# EAGLE design pacemaker (EAGLE 4.11)
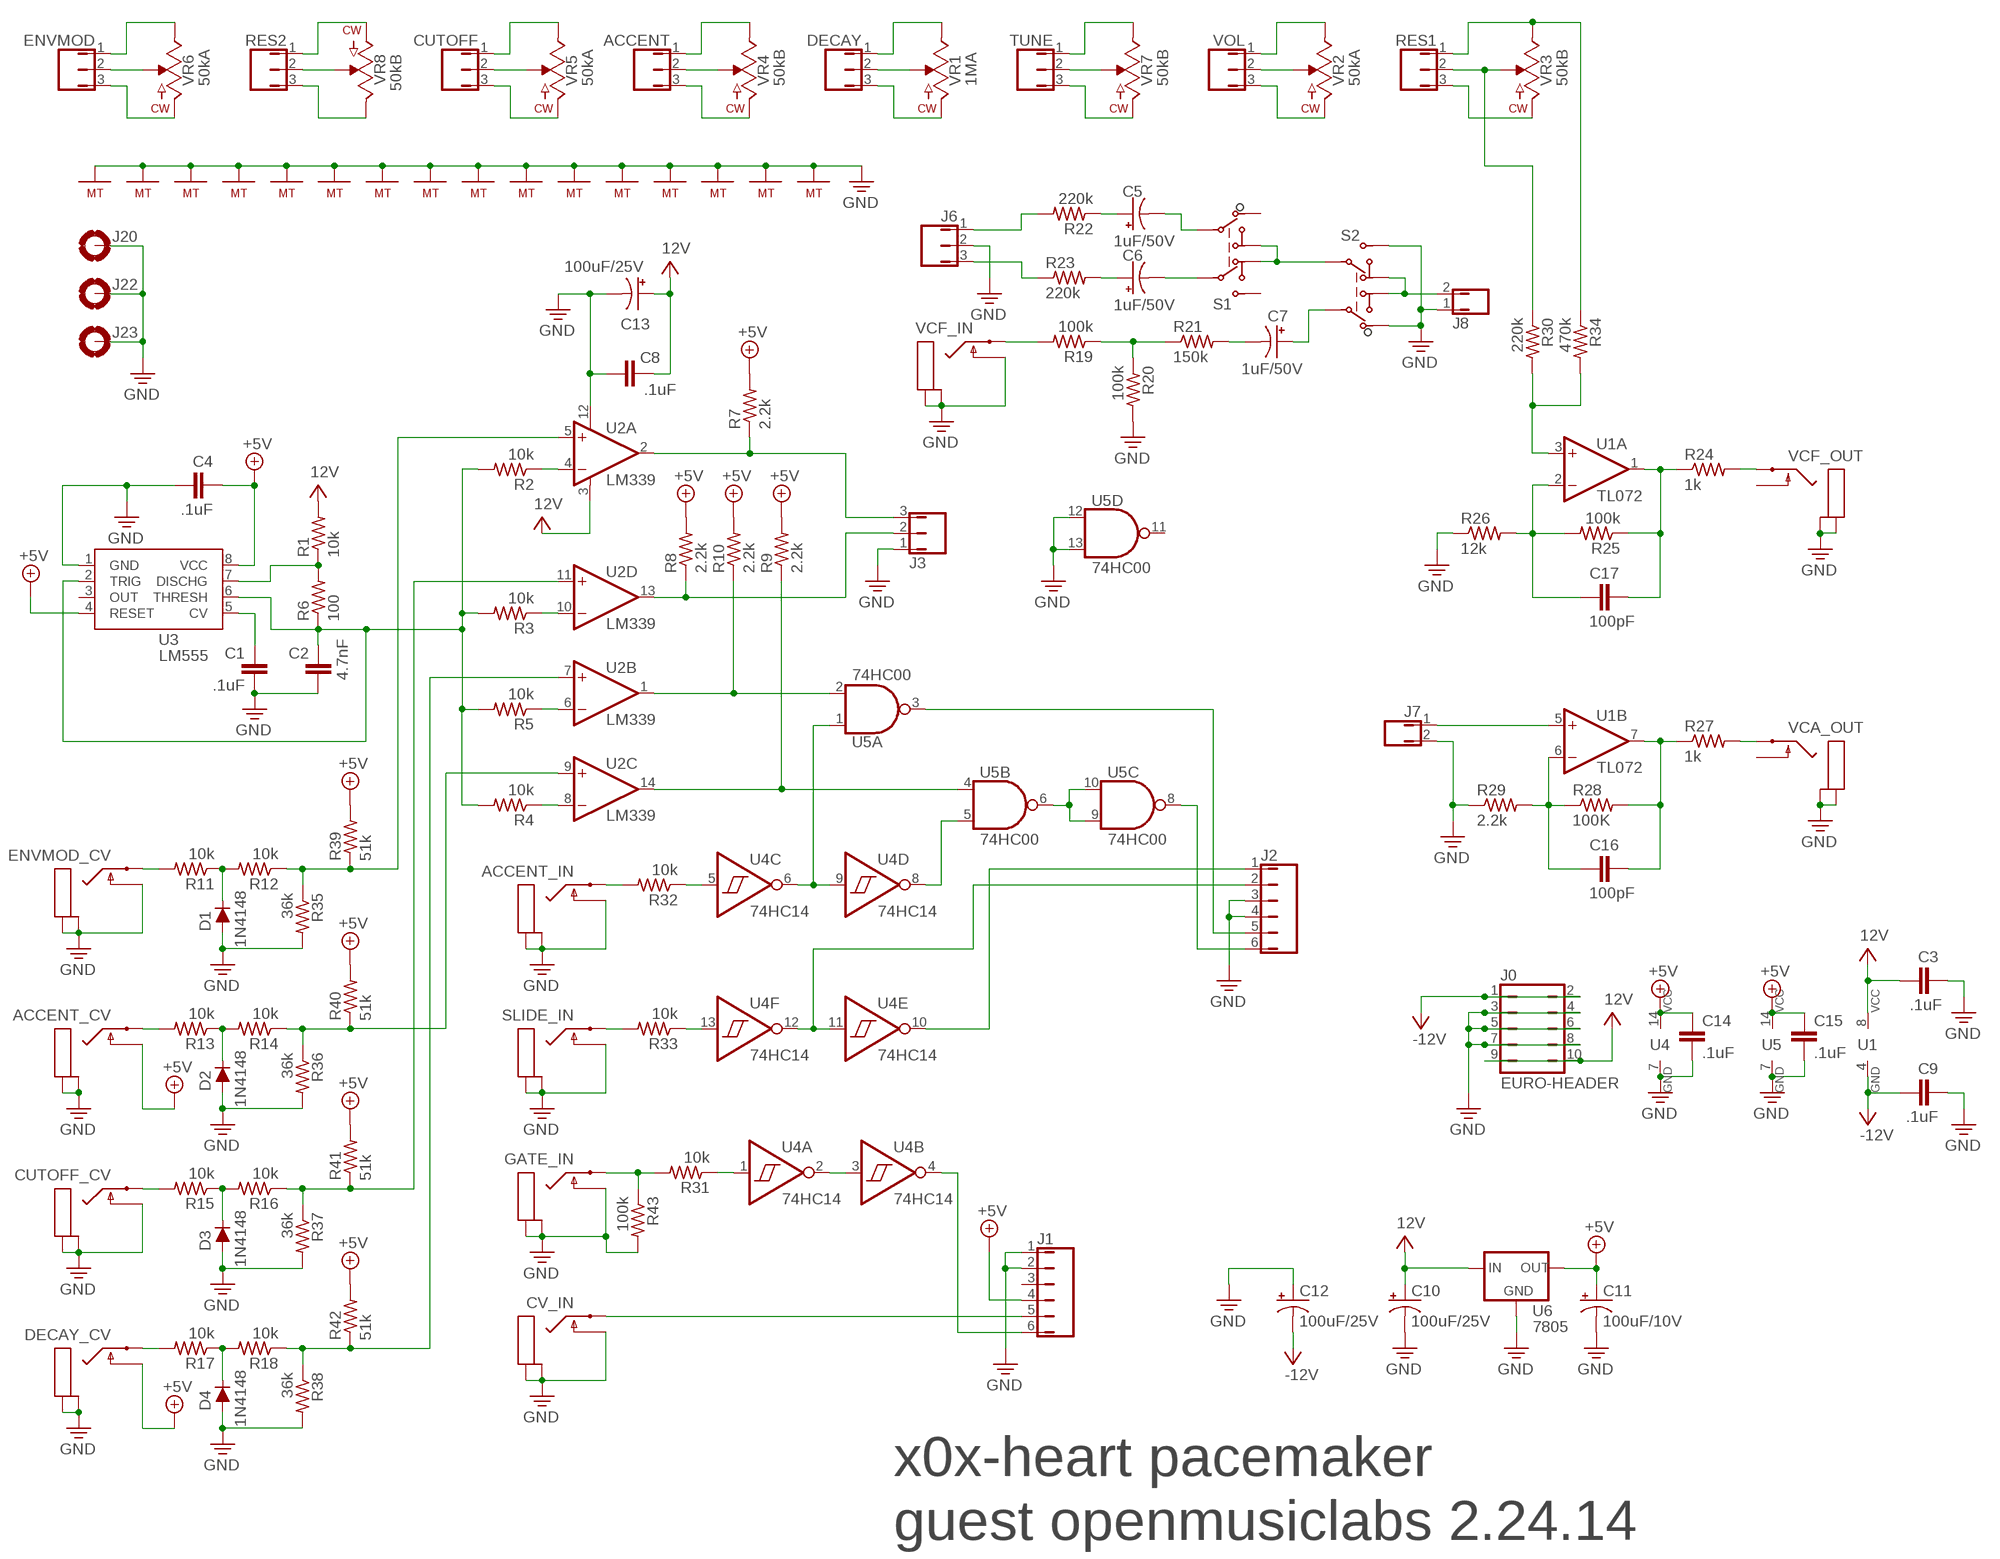
[diagram p0: schematic, sheet 1]

## Parts
ACCENT  JMP/3P/SIP  [JMP/3P/SIP]
ACCENT_CV  1/8"JACK/MONO/SWITCHED  [1/8"JACK/MONO/ERTHENVAR]
ACCENT_IN  1/8"JACK/MONO/SWITCHED  [1/8"JACK/MONO/ERTHENVAR]
C1  .1uF  CAPACITOR  [CAP/.15X.08]
C2  4.7nF  CAPACITOR  [CAP/.15X.08]
C3  .1uF  CAPACITOR  [CAP/.15X.08]
C4  .1uF  CAPACITOR  [CAP/.15X.08]
C5  1uF/50V  CAPACITOR-POL5MMX2MM  [CAP/5MMX2MM]
C6  1uF/50V  CAPACITOR-POL5MMX2MM  [CAP/5MMX2MM]
C7  1uF/50V  CAPACITOR-POL5MMX2MM  [CAP/5MMX2MM]
C8  .1uF  CAPACITOR  [CAP/.15X.08]
C9  .1uF  CAPACITOR  [CAP/.15X.08]
C10  100uF/25V  CAPACITOR-POL5MMX2MM  [CAP/5MMX2MM]
C11  100uF/10V  CAPACITOR-POL5MMX2MM  [CAP/5MMX2MM]
C12  100uF/25V  CAPACITOR-POL5MMX2MM  [CAP/5MMX2MM]
C13  100uF/25V  CAPACITOR-POL5MMX2MM  [CAP/5MMX2MM]
C14  .1uF  CAPACITOR  [CAP/.15X.08]
C15  .1uF  CAPACITOR  [CAP/.15X.08]
C16  100pF  CAPACITOR  [CAP/.15X.08]
C17  100pF  CAPACITOR  [CAP/.15X.08]
CUTOFF  JMP/3P/SIP  [JMP/3P/SIP]
CUTOFF_CV  1/8"JACK/MONO/SWITCHED  [1/8"JACK/MONO/ERTHENVAR]
CV_IN  1/8"JACK/MONO/SWITCHED  [1/8"JACK/MONO/ERTHENVAR]
D1  1N4148  DIODED0-35  [DO-35]
D2  1N4148  DIODED0-35  [DO-35]
D3  1N4148  DIODED0-35  [DO-35]
D4  1N4148  DIODED0-35  [DO-35]
DECAY  JMP/3P/SIP  [JMP/3P/SIP]
DECAY_CV  1/8"JACK/MONO/SWITCHED  [1/8"JACK/MONO/ERTHENVAR]
ENVMOD  JMP/3P/SIP  [JMP/3P/SIP]
ENVMOD_CV  1/8"JACK/MONO/SWITCHED  [1/8"JACK/MONO/ERTHENVAR]
GATE_IN  1/8"JACK/MONO/SWITCHED  [1/8"JACK/MONO/ERTHENVAR]
J0  EURO-HEADER  JMP/10P/DIPHEADER  [JMP/10P/DIP]
J1  JMP/6P/SIP  [JMP/6P/SIP]
J2  JMP/6P/SIP  [JMP/6P/SIP]
J3  JMP/3P/SIP  [JMP/3P/SIP]
J6  JMP/3P/SIP  [JMP/3P/SIP]
J7  JMP/2P/SIP  [JMP/2P/SIP]
J8  JMP/2P/SIP  [JMP/2P/SIP]
J20  HOLE-PAD4/40  [H0LE/PAD/4-40]
J22  HOLE-PAD4/40  [H0LE/PAD/4-40]
J23  HOLE-PAD4/40  [H0LE/PAD/4-40]
R1  10k  RESISTORRES-HOR-0.4  [RES-HOR-0.4]
R2  10k  RESISTORRES-HOR-0.4  [RES-HOR-0.4]
R3  10k  RESISTORRES-HOR-0.4  [RES-HOR-0.4]
R4  10k  RESISTORRES-HOR-0.4  [RES-HOR-0.4]
R5  10k  RESISTORRES-HOR-0.4  [RES-HOR-0.4]
R6  100  RESISTORRES-HOR-0.4  [RES-HOR-0.4]
R7  2.2k  RESISTORRES-HOR-0.4  [RES-HOR-0.4]
R8  2.2k  RESISTORRES-HOR-0.4  [RES-HOR-0.4]
R9  2.2k  RESISTORRES-HOR-0.4  [RES-HOR-0.4]
R10  2.2k  RESISTORRES-HOR-0.4  [RES-HOR-0.4]
R11  10k  RESISTORRES-HOR-0.4  [RES-HOR-0.4]
R12  10k  RESISTORRES-HOR-0.4  [RES-HOR-0.4]
R13  10k  RESISTORRES-HOR-0.4  [RES-HOR-0.4]
R14  10k  RESISTORRES-HOR-0.4  [RES-HOR-0.4]
R15  10k  RESISTORRES-HOR-0.4  [RES-HOR-0.4]
R16  10k  RESISTORRES-HOR-0.4  [RES-HOR-0.4]
R17  10k  RESISTORRES-HOR-0.4  [RES-HOR-0.4]
R18  10k  RESISTORRES-HOR-0.4  [RES-HOR-0.4]
R19  100k  RESISTORRES-HOR-0.4  [RES-HOR-0.4]
R20  100k  RESISTORRES-HOR-0.4  [RES-HOR-0.4]
R21  150k  RESISTORRES-HOR-0.4  [RES-HOR-0.4]
R22  220k  RESISTORRES-HOR-0.4  [RES-HOR-0.4]
R23  220k  RESISTORRES-HOR-0.4  [RES-HOR-0.4]
R24  1k  RESISTORRES-HOR-0.4  [RES-HOR-0.4]
R25  100k  RESISTORRES-HOR-0.4  [RES-HOR-0.4]
R26  12k  RESISTORRES-HOR-0.4  [RES-HOR-0.4]
R27  1k  RESISTORRES-HOR-0.4  [RES-HOR-0.4]
R28  100K  RESISTORRES-HOR-0.4  [RES-HOR-0.4]
R29  2.2k  RESISTORRES-HOR-0.4  [RES-HOR-0.4]
R30  220k  RESISTORRES-HOR-0.4  [RES-HOR-0.4]
R31  10k  RESISTORRES-HOR-0.4  [RES-HOR-0.4]
R32  10k  RESISTORRES-HOR-0.4  [RES-HOR-0.4]
R33  10k  RESISTORRES-HOR-0.4  [RES-HOR-0.4]
R34  470k  RESISTORRES-HOR-0.4  [RES-HOR-0.4]
R35  36k  RESISTORRES-HOR-0.4  [RES-HOR-0.4]
R36  36k  RESISTORRES-HOR-0.4  [RES-HOR-0.4]
R37  36k  RESISTORRES-HOR-0.4  [RES-HOR-0.4]
R38  36k  RESISTORRES-HOR-0.4  [RES-HOR-0.4]
R39  51k  RESISTORRES-HOR-0.4  [RES-HOR-0.4]
R40  51k  RESISTORRES-HOR-0.4  [RES-HOR-0.4]
R41  51k  RESISTORRES-HOR-0.4  [RES-HOR-0.4]
R42  51k  RESISTORRES-HOR-0.4  [RES-HOR-0.4]
R43  100k  RESISTORRES-HOR-0.4  [RES-HOR-0.4]
RES1  JMP/3P/SIP  [JMP/3P/SIP]
RES2  JMP/3P/SIP  [JMP/3P/SIP]
S1  SWITCH/DPDT/ON-ON-ON2MD6  [TOGGLE/2MD]
S2  SWITCH/DPDT/ON-ON-ON2MD6  [TOGGLE/2MD]
SLIDE_IN  1/8"JACK/MONO/SWITCHED  [1/8"JACK/MONO/ERTHENVAR]
TUNE  JMP/3P/SIP  [JMP/3P/SIP]
U1  TL072  OPAMP/DUALDIP  [8-DIP]
U2  LM339  COMPARATOR/QUADLM339/DIP  [14-PDIP]
U3  LM555  5558-DIP  [8-DIP]
U4  74HC14  741414-DIP  [14-PDIP]
U5  74HC00  740014-DIP  [14-PDIP]
U6  7805  78XXTO-220  [TO-220]
VCA_OUT  1/8"JACK/MONO/SWITCHED  [1/8"JACK/MONO/ERTHENVAR]
VCF_IN  1/8"JACK/MONO/SWITCHED  [1/8"JACK/MONO/ERTHENVAR]
VCF_OUT  1/8"JACK/MONO/SWITCHED  [1/8"JACK/MONO/ERTHENVAR]
VOL  JMP/3P/SIP  [JMP/3P/SIP]
VR1  1MA  POTSMALLBEAR-9MM  [SMALLBEAR-9MM]
VR2  50kA  POTSMALLBEAR-9MM  [SMALLBEAR-9MM]
VR3  50kB  POTSMALLBEAR-9MM  [SMALLBEAR-9MM]
VR4  50kB  POTSMALLBEAR-9MM  [SMALLBEAR-9MM]
VR5  50kA  POTSMALLBEAR-9MM  [SMALLBEAR-9MM]
VR6  50kA  POTSMALLBEAR-9MM  [SMALLBEAR-9MM]
VR7  50kB  POTSMALLBEAR-9MM  [SMALLBEAR-9MM]
VR8  50kB  POTSMALLBEAR-9MM  [SMALLBEAR-9MM]

## Nets
+5V: ACCENT_CV.P$2 C4.P$2 C11.P$1(+) C14.P$1 C15.P$1 DECAY_CV.P$2 J1.4 R7.P$2 R8.P$2 R9.P$2 R10.P$2 R39.P$2 R40.P$2 R41.P$2 R42.P$2 U3.4(RESET) U3.8(VCC) U4.14(VCC) U5.14(VCC) U6.P$3(OUT)
N$1: ENVMOD.2 VR6.P$2
N$2: ENVMOD.1 VR6.P$1
N$3: ENVMOD.3 VR6.P$3
N$4: RES1.3 VR3.P$3
N$5: R30.P$1 RES1.2 VR3.P$2
N$6: R34.P$1 RES1.1 VR3.P$1
N$7: CUTOFF.3 VR5.P$3
N$8: CUTOFF.1 VR5.P$1
N$9: CUTOFF.2 VR5.P$2
N$10: ACCENT.2 VR4.P$2
N$11: ACCENT.3 VR4.P$3
N$12: ACCENT.1 VR4.P$1
N$13: DECAY.2 VR1.P$2
N$14: DECAY.1 VR1.P$1
N$15: DECAY.3 VR1.P$3
N$16: TUNE.2 VR7.P$2
N$17: TUNE.3 VR7.P$3
N$18: TUNE.1 VR7.P$1
N$19: VOL.2 VR2.P$2
N$20: VOL.3 VR2.P$3
N$21: VOL.1 VR2.P$1
N$22: RES2.2 VR8.P$2
N$23: RES2.1 VR8.P$3
N$24: RES2.3 VR8.P$1
N$25: R2.P$1 U2.4(A:-IN)
N$26: R3.P$1 U2.10(D:-IN)
N$27: C1.P$2 U3.5(CV)
N$28: C2.P$2 R2.P$2 R3.P$2 R4.P$2 R5.P$2 R6.P$1 U3.2(TRIG) U3.6(THRESH)
N$29: R1.P$1 R6.P$2 U3.7(DISCHG)
N$30: R4.P$1 U2.8(C:-IN)
N$31: R5.P$1 U2.6(B:-IN)
N$32: J3.3 R7.P$1 U2.2(A:OUT)
N$33: J3.2 R8.P$1 U2.13(D:OUT)
N$34: R9.P$1 U2.14(C:OUT) U5.4(B:A)
N$35: R10.P$1 U2.1(B:OUT) U5.2(A:B)
N$36: R19.P$2 VCF_IN.P$1
N$37: D1.C R11.P$1 R12.P$2
N$38: D2.C R13.P$1 R14.P$2
N$39: D3.C R15.P$1 R16.P$2
N$40: D4.C R17.P$1 R18.P$2
N$41: DECAY_CV.P$1 R17.P$2
N$42: CUTOFF_CV.P$1 R15.P$2
N$43: ACCENT_CV.P$1 R13.P$2
N$44: ENVMOD_CV.P$1 R11.P$2
N$45: R19.P$1 R20.P$1 R21.P$1
N$46: C7.P$2(-) R21.P$2
N$47: C5.P$1(+) R22.P$1
N$48: C6.P$1(+) R23.P$2
N$49: C6.P$2(-) S1.P$5
N$50: C5.P$2(-) S1.P$2
N$51: J6.3 R23.P$1
N$52: J6.1 R22.P$2
N$53: C7.P$1(+) S2.P$2
N$54: S1.P$1 S1.P$4 S2.P$5
N$55: J8.2 S2.P$1 S2.P$4
N$56: J2.2 U4.11(E:IN) U4.12(F:OUT)
N$57: C16.P$2 R27.P$1 R28.P$2 U1.7(B:OUT)
N$58: C17.P$2 R24.P$1 R25.P$1 U1.1(A:OUT)
N$59: R24.P$2 VCF_OUT.P$1
N$60: R27.P$2 VCA_OUT.P$1
N$61: C17.P$1 R25.P$2 R26.P$2 U1.2(A:-IN)
N$62: C16.P$1 R28.P$1 R29.P$2 U1.6(B:-IN)
N$63: R30.P$2 R34.P$2 U1.3(A:+IN)
N$64: J7.1 U1.5(B:+IN)
N$65: R12.P$1 R35.P$1 R39.P$1 U2.5(A:+IN)
N$66: GATE_IN.P$1 R31.P$2 R43.P$1
N$67: R31.P$1 U4.1(A:IN)
N$68: ACCENT_IN.P$1 R32.P$2
N$69: R32.P$1 U4.5(C:IN)
N$70: R33.P$2 SLIDE_IN.P$1
N$71: R33.P$1 U4.13(F:IN)
N$72: U4.2(A:OUT) U4.3(B:IN)
N$73: U4.6(C:OUT) U4.9(D:IN) U5.1(A:A)
N$74: U4.8(D:OUT) U5.5(B:B)
N$75: U5.6(B:Y) U5.9(C:B) U5.10(C:A)
N$76: J2.1 U4.10(E:OUT)
N$77: J2.5 U5.3(A:Y)
N$78: J2.6 U5.8(C:Y)
N$79: R14.P$1 R36.P$1 R40.P$1 U2.9(C:+IN)
N$81: R16.P$1 R37.P$1 R41.P$1 U2.11(D:+IN)
N$82: R18.P$1 R38.P$1 R42.P$1 U2.7(B:+IN)
N$84: CV_IN.P$1 J1.5
N$85: J1.6 U4.4(B:OUT)
PE: ACCENT_CV.P$3 ACCENT_CV.P$4 ACCENT_IN.P$2 ACCENT_IN.P$3 ACCENT_IN.P$4 C1.P$1 C2.P$1 C3.P$1 C4.P$1 C8.P$1 C9.P$1 C10.P$2(-) C11.P$2(-) C12.P$1(+) C13.P$2(-) C14.P$2 C15.P$2 CUTOFF_CV.P$2 CUTOFF_CV.P$3 CUTOFF_CV.P$4 CV_IN.P$2 CV_IN.P$3 CV_IN.P$4 D1.A D2.A D3.A D4.A DECAY_CV.P$3 DECAY_CV.P$4 ENVMOD_CV.P$2 ENVMOD_CV.P$3 ENVMOD_CV.P$4 GATE_IN.P$2 GATE_IN.P$3 GATE_IN.P$4 J0.3 J0.4 J0.5 J0.6 J0.7 J0.8 J1.1 J1.2 J2.3 J2.4 J3.1 J6.2 J7.2 J8.1 J20.P$1(MOUNT) J22.P$1(MOUNT) J23.P$1(MOUNT) R20.P$2 R26.P$1 R29.P$1 R35.P$2 R36.P$2 R37.P$2 R38.P$2 R43.P$2 S2.P$3 S2.P$6 SLIDE_IN.P$2 SLIDE_IN.P$3 SLIDE_IN.P$4 U2.12(A:V-) U3.1(GND) U4.7(GND) U5.7(GND) U5.12(D:A) U5.13(D:B) U6.P$2(GND) VCA_OUT.P$3 VCA_OUT.P$4 VCF_IN.P$2 VCF_IN.P$3 VCF_IN.P$4 VCF_OUT.P$3 VCF_OUT.P$4 VR1.P$4(MT) VR1.P$5(MT) VR2.P$4(MT) VR2.P$5(MT) VR3.P$4(MT) VR3.P$5(MT) VR4.P$4(MT) VR4.P$5(MT) VR5.P$4(MT) VR5.P$5(MT) VR6.P$4(MT) VR6.P$5(MT) VR7.P$4(MT) VR7.P$5(MT) VR8.P$4(MT) VR8.P$5(MT) ; supply symbol labelled GND
V+: C3.P$2 C8.P$2 C10.P$1(+) C13.P$1(+) J0.9 J0.10 R1.P$2 U1.8(VCC) U2.3(A:V+) U6.P$1(IN) ; supply symbol labelled 12V
V-: C9.P$2 C12.P$2(-) J0.1 J0.2 U1.4(GND) ; supply symbol labelled -12V
Unconnected: J1.3 S1.P$3 S1.P$6 U3.3(OUT) U5.11(D:Y) VCA_OUT.P$2 VCF_OUT.P$2

## Notes on the sheet
- x0x-heart pacemaker
- guest openmusiclabs 2.24.14

## Library data of the parts
ACCENT CUTOFF DECAY ENVMOD J3 J6 RES1 RES2 TUNE VOL = audioint:JMP/3P/SIP
ACCENT_CV ACCENT_IN CUTOFF_CV CV_IN DECAY_CV ENVMOD_CV GATE_IN SLIDE_IN VCA_OUT VCF_IN VCF_OUT = audioint:1/8"JACK/MONO/SWITCHED
C1-C4 C8 C9 C14-C17 = audioint:CAPACITOR
C5-C7 C10-C13 = audioint:CAPACITOR-POL
D1-D4 = audioint:DIODE
J0 = audioint:JMP/10P/DIP
J1 J2 = audioint:JMP/6P/SIP
J7 J8 = audioint:JMP/2P/SIP
J20 J22 J23 = audioint:HOLE-PAD
R1-R43 = audioint:RESISTOR
S1 S2 = audioint:SWITCH/DPDT/ON-ON-ON
U1 = audioint:OPAMP/DUAL
U2 = audioint:COMPARATOR/QUAD
U3 = audioint:555
U4 = audioint:7414
U5 = audioint:7400
U6 = audioint:78XX
VR1-VR8 = audioint:POT

## Board
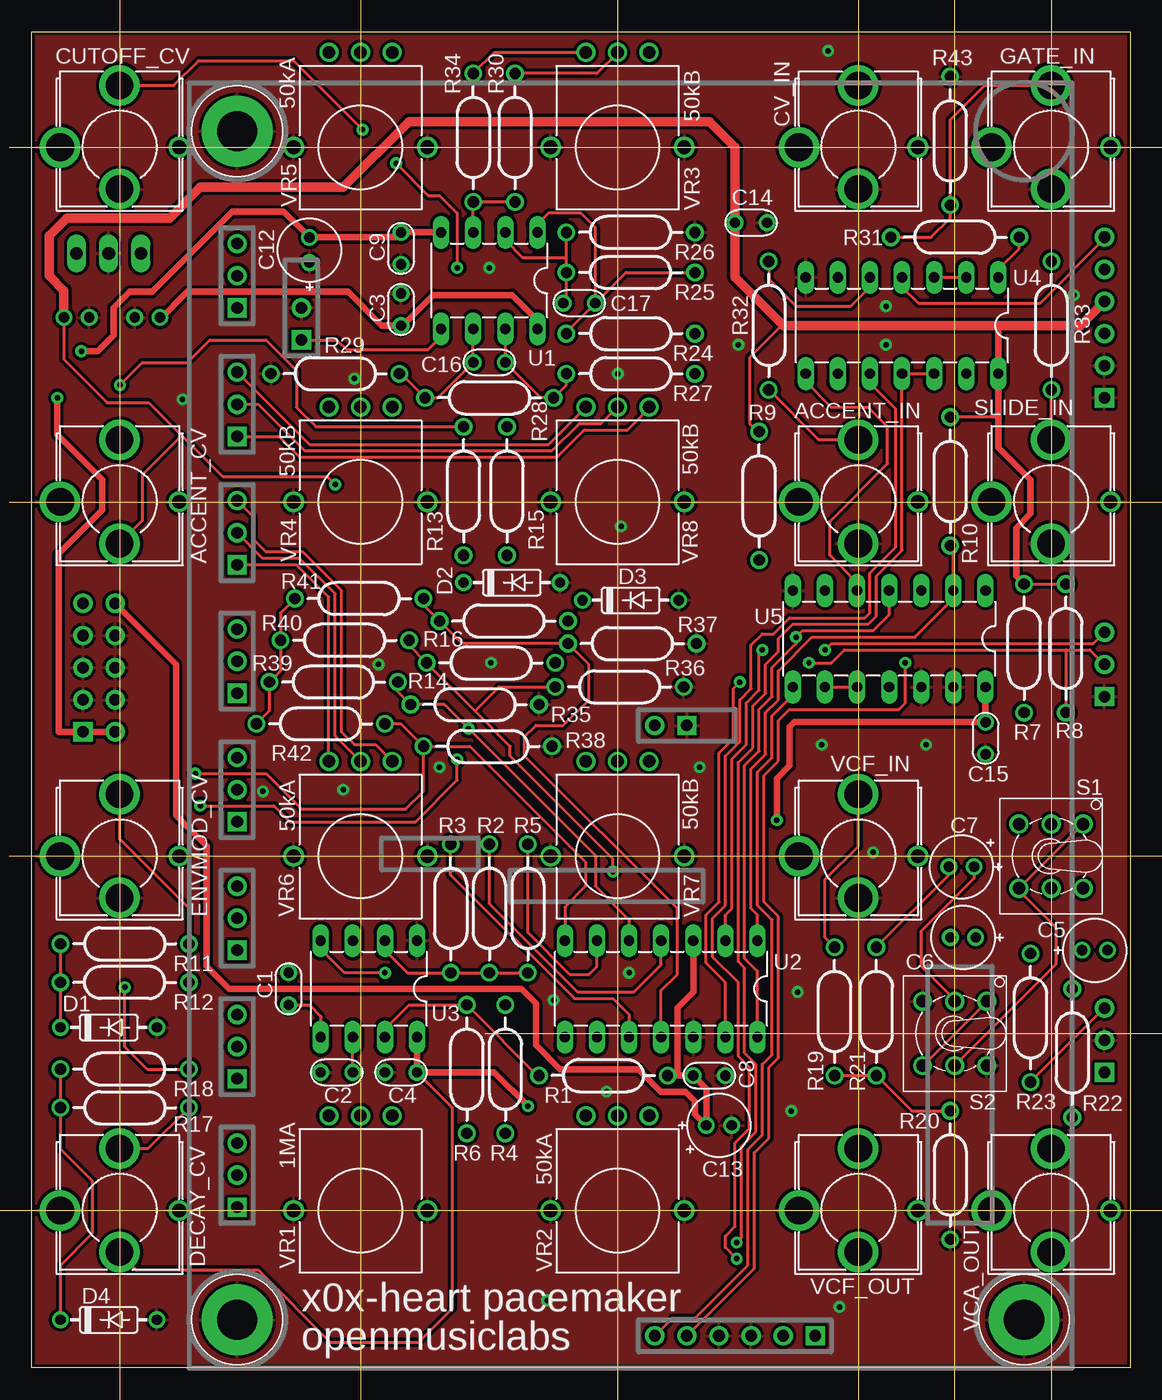
[diagram p1: board, top side]
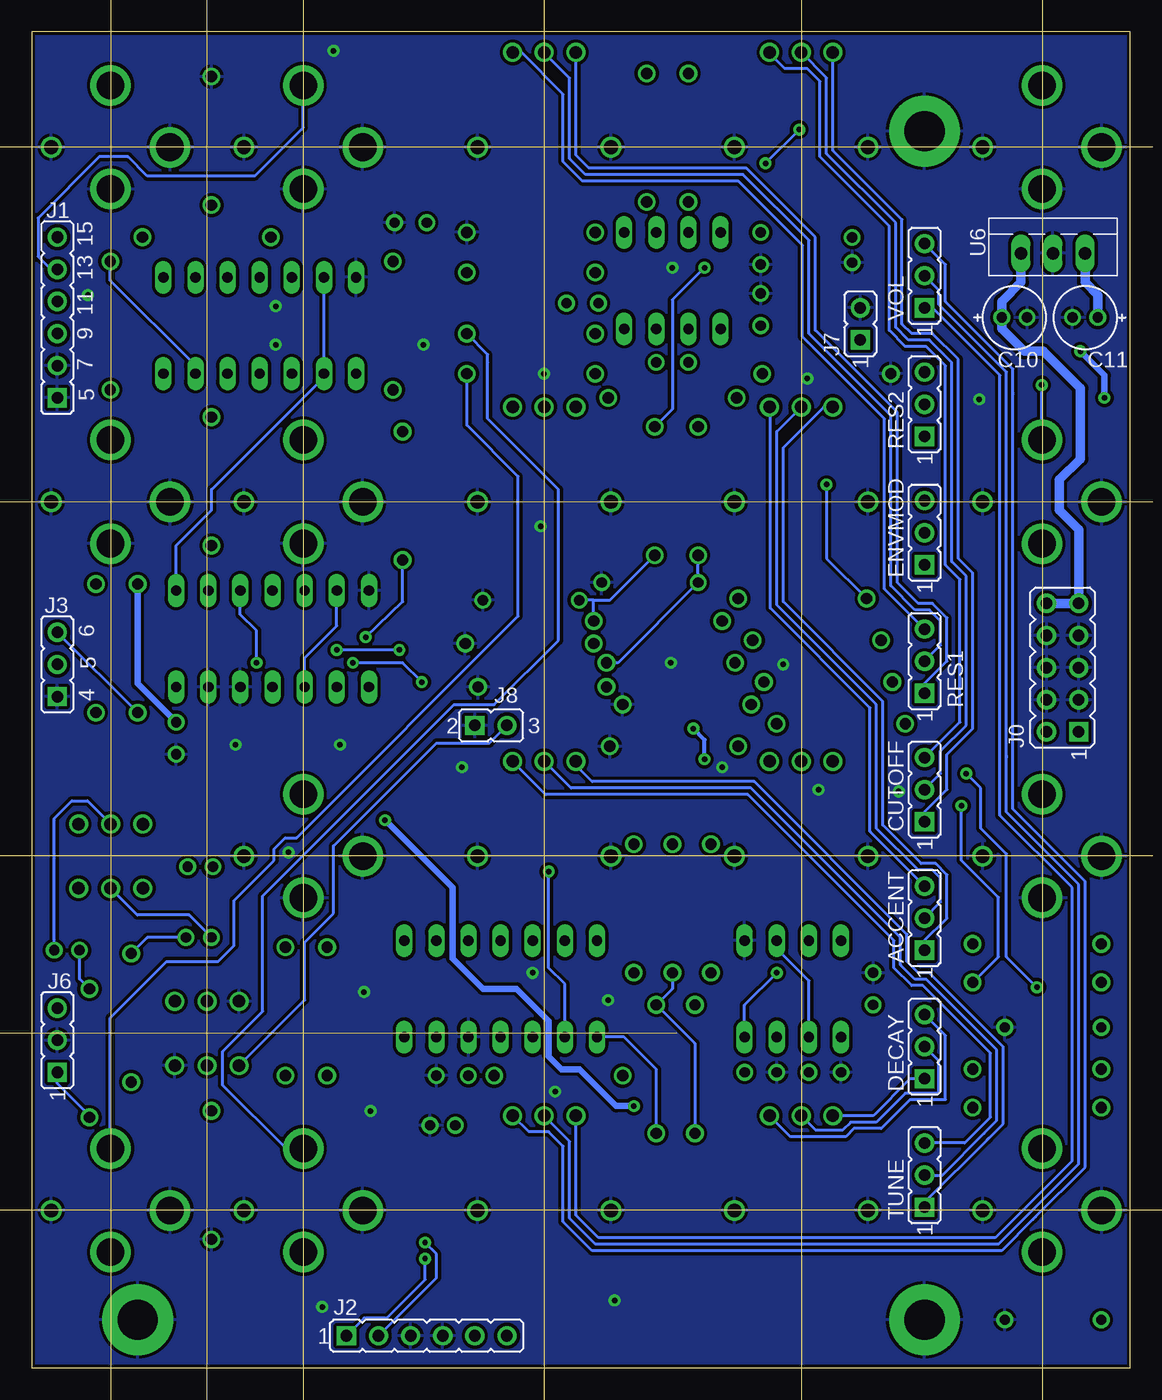
[diagram p2: board, bottom side, seen from below]

Size 86.87 x 105.66 mm. Coordinates in mm from the lower left corner, seen from the top.
Outline: 0,0 0,105.66 86.87,105.66 86.87,0 0,0
Copper layers (1*16): Top 0.035mm / dielectric 1.5mm / Bottom 0.035mm
Design rules "default": minimum track width 10mil, minimum drill 16mil, track to track 10mil, track to pad 10mil, pad to pad 10mil, via to via 10mil, smd to smd 8mil, copper to edge 10mil, drill to drill 8mil, minimum pad ring 10mil, minimum via ring 8mil, stop-mask expansion 4mil, vias tented up to drill 20mil, thermal gap 10mil
Milling: 11 lines

### Footprints (pad centres in the part's own frame; a part is rotated, then mirrored left to right if it is on the bottom)
JMP/3P/SIP = drill 0.914 pad 1.524 square: 1 -2.54,0 | drill 0.914 pad 1.524 round: 2 0,0; 3 2.54,0
1/8"JACK/MONO/ERTHENVAR = drill 2.184 round: P$1 0,4.9; P$2 0,-3.3; P$4 -4.7,0 | drill 1.092 round: P$3 4.7,0
CAP/.15X.08 = drill 0.813 pad 1.321 round: P$1 1.27,0; P$2 -1.27,0
CAP/5MMX2MM = drill 0.813 pad 1.321 round: P$1 1,0; P$2 -1,0
DO-35 = drill 0.813 pad 1.321 round: A 3.81,0; C -3.81,0
JMP/10P/DIP = drill 0.914 pad 1.524 square: 1 -1.27,5.08 | drill 0.914 pad 1.524 round: 2 1.27,5.08; 3 -1.27,2.54; 4 1.27,2.54; 5 -1.27,0; 6 1.27,0; 7 -1.27,-2.54; 8 1.27,-2.54; 9 -1.27,-5.08; 10 1.27,-5.08
JMP/6P/SIP = drill 0.914 pad 1.524 square: 1 -6.35,0 | drill 0.914 pad 1.524 round: 2 -3.81,0; 3 -1.27,0; 4 1.27,0; 5 3.81,0; 6 6.35,0
JMP/2P/SIP = drill 0.914 pad 1.524 square: 1 -1.27,0 | drill 0.914 pad 1.524 round: 2 1.27,0
H0LE/PAD/4-40 = drill 3.175 pad 5.588 round: P$1 0,0
RES-HOR-0.4 = drill 0.889 pad 1.397 round: P$1 -5.08,0; P$2 5.08,0
TOGGLE/2MD = drill 0.991 round: P$1 -2.54,2.54; P$2 -2.54,0; P$3 -2.54,-2.54; P$4 2.54,-2.54; P$5 2.54,0; P$6 2.54,2.54
8-DIP = drill 0.813 long: 1 -3.81,-3.81; 2 -1.27,-3.81; 3 1.27,-3.81; 4 3.81,-3.81; 5 3.81,3.81; 6 1.27,3.81; 7 -1.27,3.81; 8 -3.81,3.81
14-PDIP = drill 0.813 long: 1 -7.62,-3.81; 2 -5.08,-3.81; 3 -2.54,-3.81; 4 0,-3.81; 5 2.54,-3.81; 6 5.08,-3.81; 7 7.62,-3.81; 8 7.62,3.81; 9 5.08,3.81; 10 2.54,3.81; 11 0,3.81; 12 -2.54,3.81; 13 -5.08,3.81; 14 -7.62,3.81
TO-220 = drill 0.991 long: P$1 -2.54,0; P$2 0,0; P$3 2.54,0
SMALLBEAR-9MM = drill 0.991 round: P$1 -2.5,7.5; P$2 0,7.5; P$3 2.5,7.5 | drill 1.092 round: P$4 -5.283,0; P$5 5.283,0

### Placement (x,y rotation side)
ACCENT  16.26,35.56 90 bottom
ACCENT_CV  6.96,68.48 0 top
ACCENT_IN  65.38,68.48 0 top
C1  20.32,29.97 90 top
C2  24.13,23.37 180 top
C3  29.21,83.69 90 top
C4  29.21,23.37 180 top
C5  84.07,33.02 180 top
C6  73.66,34.04 0 top
C7  73.53,39.62 0 top
C8  53.59,23.11 0 top
C9  29.21,88.52 270 top
C10  9.14,83.06 180 bottom
C11  3.56,83.06 0 bottom
C12  21.97,88.39 270 top
C13  54.36,19.18 180 top
C14  56.9,90.55 180 top
C15  75.44,49.78 90 top
C16  36.2,79.5 180 top
C17  43.31,84.2 180 top
CUTOFF  16.26,45.72 90 bottom
CUTOFF_CV  6.96,96.52 0 top
CV_IN  65.38,96.52 0 top
D1  6.1,26.92 0 top
D2  37.97,62.1 0 top
D3  47.37,60.71 0 top
D4  6.1,3.81 0 top
DECAY  16.26,25.4 90 bottom
DECAY_CV  6.96,12.45 0 top
ENVMOD  16.26,66.04 90 bottom
ENVMOD_CV  6.96,40.46 0 top
GATE_IN  80.62,96.52 0 top
J0  5.33,55.37 180 bottom
J1  84.84,83.06 90 bottom
J2  55.63,2.54 0 bottom
J3  84.84,55.63 90 bottom
J6  84.84,25.91 90 bottom
J7  21.34,82.55 90 bottom
J8  50.55,50.8 0 bottom
J20  16.26,3.81 270 top
J22  78.49,3.81 270 top
J23  16.26,97.79 270 top
R1  45.21,23.11 0 top
R2  36.2,36.32 270 top
R3  33.15,36.32 270 top
R4  37.47,23.62 90 top
R5  39.24,36.32 270 top
R6  34.42,23.62 90 top
R7  78.49,56.9 90 top
R8  81.79,56.9 90 top
R9  57.53,68.96 90 top
R10  72.64,70.1 90 top
R11  7.37,33.53 0 top
R12  7.37,30.48 180 top
R13  34.16,69.34 90 top
R14  36.32,55.75 0 top
R15  37.59,69.34 90 top
R16  37.34,59.05 0 top
R17  7.37,20.57 0 top
R18  7.37,23.62 180 top
R19  63.5,28.19 90 top
R20  72.64,15.24 270 top
R21  66.8,28.19 90 top
R22  82.3,24.89 270 top
R23  78.99,27.69 90 top
R24  47.37,81.79 0 top
R25  47.37,86.61 180 top
R26  47.37,89.79 180 top
R27  47.37,78.61 0 top
R28  36.2,76.71 0 top
R29  24,78.61 0 top
R30  38.23,97.28 270 top
R31  73.02,89.41 180 top
R32  58.29,82.42 270 top
R33  80.64,82.42 270 top
R34  34.93,97.28 270 top
R35  35.05,52.45 0 top
R36  46.48,53.85 0 top
R37  47.5,57.28 0 top
R38  36.07,49.15 0 top
R39  23.88,54.23 180 top
R40  24.77,57.53 180 top
R41  25.91,60.83 180 top
R42  22.86,50.93 180 top
R43  72.64,97.03 90 top
RES1  16.26,55.88 90 bottom
RES2  16.26,76.2 90 bottom
S1  80.62,40.46 270 top
S2  73,26.44 270 top
SLIDE_IN  80.62,68.48 0 top
TUNE  16.26,15.24 90 bottom
U1  36.2,85.98 180 top
U2  49.78,29.97 180 top
U3  26.67,29.97 180 top
U4  68.83,82.42 180 top
U5  67.82,57.66 180 top
U6  6.1,88.14 0 bottom
VCA_OUT  80.62,12.45 0 top
VCF_IN  65.38,40.46 0 top
VCF_OUT  65.38,12.45 0 top
VOL  16.26,86.36 90 bottom
VR1  26.01,12.45 0 top
VR2  46.33,12.45 0 top
VR3  46.33,96.52 0 top
VR4  26.01,68.48 0 top
VR5  26.01,96.52 0 top
VR6  26.01,40.46 0 top
VR7  46.33,40.46 0 top
VR8  46.33,68.48 0 top

### Tracks (layer width: path | path; a pad name or v marks a point on that pad's centre or on a via)
+5V  (via drill 0.43 pad 0.94)
  Top 0.254: R7.P$2 R8.P$2 | v27.94,31.24 24.77,31.24 22.86,33.15 U3.4 | v24,69.85 23.37,70.48 15.11,70.48 11.87,73.72 | C11.P$1 2.54,83.06 2.54,79.76 5.97,76.33 9.27,76.33 11.87,73.72 | R39.P$2 18.8,54.36 | R42.P$2 18.8,51.94 R39.P$2 | R39.P$2 19.69,55.12 R40.P$2 19.69,59.69 R41.P$2 | 59.44,82.55 59.37,82.49 56.77,79.88 56.77,74.68 57.53,73.91 R9.P$2 | 76.45,74.42 76.58,74.42 | 76.58,75.18 76.45,75.18 R10.P$2 | C4.P$2 33.27,20.57 33.27,4.7 30.61,2.03 23.62,2.03 17.91,7.75 8.25,7.75 6.96,9.04 DECAY_CV.P$2 | ACCENT_CV.P$2 8.76,66.98 8.76,70.61 11.87,73.72
  Top 0.508: U5.14 C15.P$1 60.33,51.05 59.94,50.67 59.94,47.62 58.93,46.61 v58.93,43.31 | 76.45,74.93 76.45,74.42 76.45,72.77 78.99,70.23 78.99,67.56 77.85,66.42 77.85,62.61 R7.P$2 | 76.45,74.93 76.45,75.18 | 30.48,26.29 U3.8 C4.P$2 36.58,23.37 v39.24,20.7 | U4.14 76.45,78.49 | U4.14 76.45,82.42 | 76.45,74.93 U4.14
  Top 0.762: C11.P$1 2.56,85.2 1.4,86.36 1.4,89.53 2.79,90.93 10.92,90.93 13.33,93.34 24.64,93.34 29.85,98.55 53.59,98.55 55.63,96.52 C14.P$1 55.63,86.23 59.37,82.49 59.44,82.42 76.45,82.42 82.93,82.42 J1.4
  Bottom 0.254: U3.8 30.48,28.7 v27.94,31.24 | R41.P$2 24,64.01 v24,69.85
  Bottom 0.508: C11.P$1 2.54,83.06 | v39.24,20.7 40.64,20.7 43.56,23.62 44.96,23.62 45.97,24.64 45.97,27.43 48.51,29.97 51.18,29.97 53.59,32.38 53.59,37.97 v58.93,43.31 | C15.P$1 78.49,54.1 R7.P$2
  Bottom 0.762: U6.P$3 3.56,85.85 2.54,84.84 2.54,83.06
N$1
  Top 0.254: VR6.P$2 24,49.97 24,61.21 21.21,64.01 18.29,64.01 ENVMOD.2
N$2
  Top 0.254: 23.45,47.96 23.37,47.88 | VR6.P$1 23.45,47.96 | 23.5,60.2 23.5,48.01 23.45,47.96 | 23.5,60.2 23.5,60.33 | ENVMOD.1 20.96,63.5 23.5,60.96 23.5,60.2
N$3
  Top 0.254: VR6.P$3 27.2,49.28 25.53,49.28 24.51,50.29 24.51,61.47 21.46,64.52 20.7,64.52 | 20.7,64.52 18.54,64.52 17.53,65.53 17.53,67.31 ENVMOD.3 | 20.7,64.52 20.83,64.52
N$4
  Bottom 0.254: RES1.3 19.43,61.59 19.43,75.06 25.91,81.53 25.91,88.77 30.99,93.85 43.31,93.85 44.83,95.38 44.83,100.71 48.14,104.02 VR3.P$3
N$5
  Top 0.254: VR3.P$2 46.35,104.02 46.36,104.01 44.7,102.36 R30.P$1
  Bottom 0.254: RES1.2 14.99,57.15 14.99,59.05 15.87,59.94 17.02,59.94 18.92,61.85 18.92,75.31 25.4,81.79 25.4,89.15 30.61,94.36 43.05,94.36 44.32,95.63 44.32,101.98 46.36,104.01 46.35,104.02 VR3.P$2 46.34,104.01
N$6
  Top 0.254: VR3.P$1 43.82,104.01 36.58,104.01 R34.P$1 34.8,102.23
  Bottom 0.254: RES1.1 16.26,54.1 14.48,55.88 14.48,59.31 15.62,60.45 16.76,60.45 18.42,62.1 18.42,75.56 24.89,82.04 24.89,89.41 30.35,94.87 42.8,94.87 43.82,95.89 43.82,104.14 43.83,104.12 VR3.P$1
N$7
  Bottom 0.254: CUTOFF.3 13.46,51.05 13.46,62.36 14.6,63.5 14.6,79.25 16.13,80.77 17.78,80.77 19.05,82.04 19.05,90.3 24.51,95.76 24.51,101.73 25.53,102.74 27.3,102.74 28.58,104.01 28.57,104.02 VR5.P$3
N$8
  Bottom 0.254: CUTOFF.1 16.26,43.94 14.48,45.72 14.48,48.51 12.45,50.55 12.45,62.86 13.59,64.01 13.59,79.76 15.62,81.79 17.27,81.79 18.03,82.55 18.03,90.8 23.5,96.27 23.5,104.01 VR5.P$1
N$9
  Bottom 0.254: CUTOFF.2 14.99,46.99 14.99,48.77 12.95,50.8 12.95,62.61 14.1,63.75 14.1,79.5 15.87,81.28 17.53,81.28 18.54,82.3 18.54,90.55 24,96.01 24,102.01 VR5.P$2
N$10
  Bottom 0.254: ACCENT.2 14.99,36.83 14.99,38.73 15.62,39.37 16.76,39.37 20.07,42.67 20.07,52.45 27.94,60.33 27.94,74.04 VR4.P$2
N$11
  Bottom 0.254: ACCENT.3 20.57,42.42 20.57,52.2 28.45,60.07 28.45,76.04 | 28.45,76.04 28.45,76.07 | 28.45,76.04 VR4.P$3
N$12
  Bottom 0.254: VR4.P$1 24.23,75.98 27.43,72.77 27.43,60.58 19.56,52.7 19.56,42.93 16.51,39.88 15.37,39.88 14.48,38.99 14.48,35.56 16.26,33.78 ACCENT.1 16.26,32.89
N$13
  Bottom 0.254: VR1.P$2 24.86,18.8 22.73,18.8 22.1,19.43 20.07,19.43 17.78,21.72 15.11,21.72 15.11,24.26 DECAY.2
N$14
  Bottom 0.254: VR1.P$1 20.31,19.95 17.4,22.86 DECAY.1 16.13,22.86
N$15
  Bottom 0.254: VR1.P$3 26.85,18.29 22.48,18.29 21.84,18.92 19.69,18.92 17.4,21.21 14.6,21.21 14.6,26.29 DECAY.3
N$16
  Bottom 0.254: 11.49,18.61 10.54,19.56 10.54,25.15 16.13,30.73 17.02,30.73 18.16,31.88 18.16,34.04 29.97,45.85 44.2,45.85 46.33,47.98 | 11.49,18.61 11.56,18.54 | 46.33,47.98 46.36,48.01 | 46.33,47.98 VR7.P$2 | 15.62,15.24 14.99,15.24 | 15.62,15.24 TUNE.2 | 11.49,18.61 14.86,15.24 15.62,15.24
N$17
  Bottom 0.254: 48.85,47.96 48.9,48.01 | 48.85,47.96 VR7.P$3 | 48.85,47.96 46.23,45.34 30.23,45.34 18.67,33.78 18.67,31.62 17.27,30.23 16.38,30.23 11.05,24.89 11.05,19.81 13.08,17.78 TUNE.3
N$18
  Bottom 0.254: 11.18,18.16 10.03,19.3 10.03,25.4 15.87,31.24 16.76,31.24 17.65,32.13 17.65,34.29 29.72,46.35 42.55,46.35 43.94,47.75 43.94,48.01 43.87,48.01 VR7.P$1 | 11.18,18.16 11.3,18.03 | TUNE.1 16.26,13.08 11.18,18.16
N$19
  Bottom 0.254: VOL.2 15.11,85.22 15.11,84.07 9.78,78.74 9.78,48.39 | VR2.P$2 46.35,19.95 46.36,19.94 44.32,17.91 44.32,11.81 42.29,9.78 10.41,9.78 4.06,16.13 4.06,38.23 9.78,43.94 9.78,48.39 | 9.78,48.39 9.78,48.26
N$20
  Bottom 0.254: VR2.P$3 47.55,18.67 45.97,18.67 44.83,17.53 44.83,11.56 42.55,9.27 10.16,9.27 7.68,11.75 7.49,11.94 | VOL.3 14.6,87.25 14.6,84.33 9.27,78.99 9.27,76.96 | 9.27,76.96 9.27,77.09 | 9.27,76.96 9.27,44.2 3.56,38.48 3.56,15.87 7.49,11.94 | 7.49,11.94 7.62,11.81
N$21
  Bottom 0.254: VOL.1 15.62,83.82 10.29,78.49 10.29,43.69 4.57,37.97 4.57,16.38 10.67,10.29 42.04,10.29 43.82,12.06 43.82,19.94 VR2.P$1
N$22
  Top 0.254: RES2.2 17.91,76.2 21.59,72.52 41.15,72.52 43.31,74.68 45.03,74.68 VR8.P$2
N$23
  Top 0.254: RES2.1 19.56,73.66 21.21,72.01 41.53,72.01 43.69,74.17 47.12,74.17 48.9,75.95 48.86,75.98 VR8.P$3
N$24
  Top 0.254: RES2.3 21.97,73.02 40.89,73.02 43.83,75.96 VR8.P$1
N$25
  Top 0.254: U2.4 49.78,31.88 47.62,29.72 43.18,29.72 36.2,36.7 R2.P$1
N$26
  Top 0.254: R3.P$1 33.15,38.99 42.93,29.21 45.97,29.21 47.24,27.94 U2.10
N$27
  Top 0.254: C1.P$2 21.97,28.7 22.86,27.81 U3.5 22.86,26.03
N$28
  Top 0.254: C2.P$2 U3.6 | R2.P$2 36.07,31.24 | R2.P$2 R5.P$2 | R2.P$2 R3.P$2 29.72,31.24 27.94,33.02 U3.2
  Bottom 0.254: U3.6 25.4,30.61 27.94,33.15 U3.2 | R6.P$1 34.42,25.65 R4.P$2 36.2,29.97 R2.P$2
N$29
  Top 0.254: U3.7 27.94,26.8 29.85,28.7 R6.P$2 40.13,22.99 R1.P$1
N$30
  Bottom 0.254: R4.P$1 37.47,23.62 40.01,26.16 U2.8
N$31
  Top 0.254: R5.P$1 39.24,34.42 42.55,31.11 44.07,31.11 44.7,31.75 U2.6
N$32  (via drill 0.43 pad 0.94)
  Top 0.254: U2.2 54.86,35.81 55.37,36.32 55.37,48.13 56.52,49.28 56.52,52.58 57.53,53.59 57.53,56.52 v57.79,56.77 | v62.74,56.77 63.25,57.28 83.95,57.28 J3.3
  Bottom 0.254: v57.79,56.77 v62.74,56.77 | J3.3 R7.P$1
N$33  (via drill 0.43 pad 0.94)
  Top 0.254: U2.13 54.86,30.48 53.34,32 53.34,35.81 54.36,36.83 54.36,48.64 55.5,49.78 55.5,53.72 v56.01,54.23 | 84.71,55.75 J3.2 83.69,56.77 81.79,56.77 | v61.47,55.75 63.25,55.75 64.26,56.77 81.79,56.77 | 81.79,56.77 R8.P$1
  Bottom 0.254: v56.01,54.23 57.53,55.75 v61.47,55.75
N$34  (via drill 0.43 pad 0.94)
  Top 0.254: U2.14 57.4,31.37 56.39,32.38 56.39,47.62 57.53,48.77 57.53,52.07 58.55,53.09 58.55,55.37 60.45,57.28 v60.45,57.78 60.96,58.29 66.55,58.29 67.82,59.56 U5.4
  Bottom 0.254: R9.P$1 57.53,60.58 v60.45,57.78
N$35
  Top 0.254: U2.1 57.4,35.81 56.9,36.32 56.9,47.37 58.04,48.51 58.04,51.82 59.05,52.83 59.05,55.12 61.72,57.78 68.07,57.78 69.85,57.78 72.9,60.83 72.9,61.34 | 72.9,61.34 U5.2 | R10.P$1 72.9,64.77 72.9,61.34
N$36
  Top 0.254: VCF_IN.P$1 65.38,41.25 62.74,38.61 62.74,34.04 R19.P$2
N$37
  Top 0.254: R11.P$1 R12.P$2 D1.C
N$38
  Bottom 0.254: R14.P$2 40.51,55.75 D2.C R13.P$1 34.16,64.39
N$39
  Bottom 0.254: R15.P$1 41.15,60.71 42.42,60.71 | 42.42,60.71 D3.C | R16.P$2 42.42,60.71
N$40
  Top 0.254: R17.P$1 2.29,20.32 | R17.P$1 R18.P$2 | R17.P$1 2.29,17.27 4.83,14.73 4.83,10.67 2.29,8.13 D4.C 2.29,3.56
N$41
  Top 0.254: DECAY_CV.P$1 9.22,17.35 R17.P$2
N$42  (via drill 0.43 pad 0.94)
  Top 0.254: CUTOFF_CV.P$1 11.25,101.42 13.21,103.38 20.7,103.38 v26.16,97.92 | v28.83,95.25 31.37,92.71 32.26,92.71 33.66,91.31 v33.66,87
  Bottom 0.254: v26.16,97.92 v28.83,95.25 | R15.P$2 36.58,75.44 36.2,75.82 36.2,84.45 v33.66,87
N$43  (via drill 0.43 pad 0.94)
  Top 0.254: R13.P$2 22.48,74.42 20.96,75.95 20.96,78.87 18.54,81.28 14.1,81.28 12.32,79.5 8.76,79.5 v6.98,77.72
  Bottom 0.254: 6.98,73.35 6.98,73.28 | ACCENT_CV.P$1 6.98,73.35 | 6.98,73.35 v6.98,77.72
N$44
  Top 0.254: ENVMOD_CV.P$1 6.96,41.81 12.45,36.32 R11.P$2
N$45
  Top 0.254: R19.P$1 R21.P$1 69.6,20.32 R20.P$1
N$46
  Top 0.254: C7.P$2 72.52,39.62 72.52,38.99 R21.P$2
N$47
  Bottom 0.254: C5.P$1 83.07,30.75 R22.P$1
N$48
  Bottom 0.254: C6.P$1 77.72,34.04 R23.P$2
N$49
  Bottom 0.254: S1.P$5 78.51,35.81 74.42,35.81 72.64,34.04 C6.P$2
N$50
  Bottom 0.254: S1.P$2 82.45,44.83 83.69,44.83 85.09,43.43 85.09,33.02 C5.P$2
N$51
  Top 0.254: R23.P$1 J6.3
N$52
  Bottom 0.254: R22.P$2 82.17,19.81 84.84,22.48 J6.1
N$53
  Top 0.254: 73.13,28.98 73.15,28.96 | S2.P$2 73.13,28.98 | 73.13,28.98 70.36,31.75 70.36,34.54 74.55,38.73 74.55,39.62 C7.P$1
N$54
  Top 0.254: S1.P$1 S1.P$4 78,37.85 77.98,37.85 81.03,34.8 81.03,31.93 S2.P$5
N$55
  Top 0.254: S2.P$4 70.48,23.88 75.54,28.93 S2.P$1
  Bottom 0.254: J8.2 50.67,49.4 54.86,49.4 62.99,41.27 62.99,35.94 65.28,33.66 65.28,29.08 S2.P$4 70.48,23.88
N$56  (via drill 0.43 pad 0.94)
  Top 0.254: v55.75,9.91 56.13,10.29 56.13,17.53 57.28,18.67 57.28,24 56.39,24.89 56.39,31.62 55.88,32.13 55.88,47.88 57.02,49.02 57.02,52.32 58.04,53.34 58.04,55.63 59.05,56.64 59.05,57.66 60.2,58.8 66.17,58.8 66.8,59.44 66.8,62.61 68.83,64.64 U4.11 U4.12
  Bottom 0.254: J2.2 54.86,7.11 54.86,9.02 v55.75,9.91
N$57
  Top 0.254: C16.P$2 U1.7 | C16.P$2 37.59,79.38 | R27.P$1 42.29,77.72 R28.P$2 40.26,76.71 C16.P$2
N$58
  Top 0.254: R25.P$1 46.99,86.61 C17.P$2 | C17.P$2 42.29,81.91 R24.P$1 | U1.1 40.01,90.42 40.89,91.31 43.43,91.31 44.58,90.17 C17.P$2
N$59
  Bottom 0.254: VCF_OUT.P$1 66.75,17.35 71.75,22.35 71.75,25.02 68.58,28.19 68.58,37.34 53.47,52.45 50.29,52.45 45.21,57.53 45.21,69.47 50.8,75.06 50.8,79.5 50.8,80.14 R24.P$2
N$60
  Bottom 0.254: R27.P$2 52.45,74.55 48.39,70.48 48.39,59.44 65.91,41.91 66.8,41.91 67.69,41.02 67.69,40.13 70.87,36.96 70.87,33.4 72.14,32.13 76.2,32.13 80.64,27.69 80.64,17.27 80.62,17.3 VCA_OUT.P$1
N$61
  Top 0.254: 42.29,87.76 R25.P$2 42.29,84.45 C17.P$1 | 42.29,87.76 R26.P$2 | U1.2 37.47,89.15 38.86,87.76 42.29,87.76
N$62
  Top 0.254: U1.6 34.93,79.63 35.05,79.5 C16.P$1 32.13,76.71 R28.P$1 29.21,78.61 R29.P$2
N$63
  Top 0.254: U1.3 R34.P$2 R30.P$2
N$64
  Top 0.254: U1.5 32.38,81.53 31.37,80.52 24.89,80.52 24.13,81.28 J7.1
N$65  (via drill 0.43 pad 0.94)
  Top 0.254: R39.P$1 28.96,53.47 R35.P$1 32.64,52.45 v34.54,50.55 44.58,40.51 44.58,38.1 47.24,35.43 U2.5 | v33.66,48.13 33.66,46.48 30.35,43.18 20.45,43.18 19.18,44.45 v13.33,44.45
  Bottom 0.254: v13.33,44.45 13.33,40.13 10.41,37.21 10.41,32.51 R12.P$1
  Bottom 0.305: v33.66,48.13 33.66,49.66 v34.54,50.55
N$66
  Top 0.254: GATE_IN.P$1 75.38,101.42 72.64,98.68 R43.P$1 72.64,90.93 71.12,89.41 R31.P$2 67.82,89.41
N$67
  Top 0.254: R31.P$1 78.1,88.52 76.45,86.87 U4.1 76.45,86.11
N$68
  Top 0.254: ACCENT_IN.P$1 65.41,73.4 65.41,73.41 62.23,73.41 R32.P$2
N$69
  Top 0.254: R32.P$1 58.29,86.11 60.45,83.95 64.77,83.95 66.29,85.47 U4.5
N$70
  Top 0.254: 80.64,73.35 80.64,73.28 | SLIDE_IN.P$1 80.64,73.35 | 80.64,73.35 R33.P$2
N$71
  Bottom 0.254: R33.P$1 80.64,85.98 73.91,79.25 U4.13
N$72
  Top 0.254: U4.3 U4.2
N$73
  Bottom 0.254: 63.75,78.87 U4.9 | 63.75,78.87 U4.6 | U5.1 75.44,65.02 72.64,67.82 72.64,69.47 63.75,78.36 63.75,78.87
N$74
  Top 0.254: 64.39,75.95 66.17,75.95 67.69,74.42 67.69,71.5 63.12,66.93 63.12,64.26 65.28,62.1 U5.5 | 64.39,75.95 63.88,75.95 | U4.8 61.21,77.98 63.25,75.95 64.39,75.95
N$75
  Top 0.254: U5.9 U5.10
  Bottom 0.254: U5.6 62.74,58.67 65.28,56.13 U5.10
N$76  (via drill 0.43 pad 0.94)
  Top 0.254: v55.75,8.64 54.86,9.53 54.86,10.41 55.63,11.18 55.63,17.78 56.77,18.92 56.77,23.75 55.88,24.64 55.88,30.48 53.85,32.51 53.85,35.56 54.86,36.58 54.86,48.39 56.01,49.53 56.01,52.83 56.9,53.72 56.9,57.15 57.79,58.04 58.67,58.04 59.94,59.31 65.91,59.31 66.29,59.69 66.29,62.86 68.33,64.9 68.33,75.82 66.29,77.85 U4.10
  Bottom 0.254: J2.1 60.58,3.94 58.8,3.94 55.75,6.99 v55.75,8.64
N$77  (via drill 0.43 pad 0.94)
  Top 0.254: J2.5 57.15,7.87 57.15,17.02 58.29,18.16 58.29,23.75 59.05,24.51 59.05,35.69 57.91,36.83 57.91,46.86 59.05,48.01 59.05,51.18 59.94,52.07 68.58,52.07 69.09,52.58 v69.09,55.75
  Bottom 0.254: v69.09,55.75 69.09,58.29 70.36,59.56 U5.3
N$78
  Top 0.254: 60.2,53.97 U5.8 60.2,53.21 58.55,51.56 58.55,48.26 57.4,47.12 57.4,36.58 58.55,35.43 58.55,24.77 57.79,24 57.79,18.41 56.64,17.27 56.64,8.13 52.45,3.94 50.67,3.94 J2.6
N$79  (via drill 0.43 pad 0.94)
  Top 0.254: R40.P$1 29.85,57.15 R14.P$1 35.05,51.94 | 35.05,51.94 37.85,49.15 37.85,48.39 45.97,40.26 v45.97,39.24 | R36.P$1 36.96,53.85 35.05,51.94
  Bottom 0.254: U2.9 44.7,30.35 45.97,31.62 v45.97,39.24
N$81
  Top 0.254: R16.P$1 32.38,58.93 | R41.P$1 30.99,60.33 R16.P$1 | R16.P$1 34.04,57.28 R37.P$1 44.07,55.63 44.07,52.83 42.04,50.8 39.88,50.8 38.99,49.91 38.99,48.39 51.05,36.32 51.05,31.11 49.78,29.84 U2.11
N$82  (via drill 0.43 pad 0.94)
  Top 0.254: R42.P$1 29.21,50.93 R38.P$1 | R38.P$1 30.99,45.59 29.59,44.2 21.34,44.2 18.54,46.99 v12.95,46.99 | v7.37,30.1 7.37,25.4 9.14,23.62 R18.P$1 | R38.P$1 34.67,49.15 43.82,40 43.82,38.1 42.16,36.45 U2.7
  Bottom 0.254: v12.95,46.99 11.81,45.85 11.81,42.67 9.78,40.64 9.78,32.51 v7.37,30.1
N$84
  Bottom 0.254: CV_IN.P$1 65.38,98.07 69.21,94.23 77.72,94.23 79.25,95.76 81.53,95.76 86.36,90.93 86.36,87.88 85.34,86.87 J1.5
N$85
  Top 0.254: U4.4 68.83,85.47 70.1,84.2 79.76,84.2 84.96,89.41 J1.6
PE  (via drill 0.43 pad 0.94)
  other vias: 46.61,66.55 47.24,31.24 27.43,55.63 66.55,40.77 36.2,87 67.56,83.95 60.58,29.72 60.07,20.32 62.48,49.28 70.74,49.28 63.88,4.83 45.47,21.84 55.88,80.9 62.99,104.14 46.36,78.61 25.53,78.23 40.77,5.33 52.83,47.5 82.42,84.84 41.27,29.08 36.32,55.75 11.94,76.58 18.29,45.59 32.26,47.5 24.64,45.72 67.56,80.9
  pour Bottom: 0,105.66 0,0 86.87,0 86.87,105.66
  pour Top: 0,105.66 0,0 86.87,0 86.87,105.66
V+
  Top 0.508: C10.P$1 10.14,82.95 10.16,82.93 12.32,85.09 25.02,85.09 27.69,82.42 29.08,82.42 29.21,82.3 | J0.10 11.43,55.63 11.43,43.69 13.84,41.27 13.84,31.75 15.62,29.97 38.73,29.97 39.88,28.83 39.88,25.53 41.78,23.62 46.99,23.62 | 46.99,23.62 47.12,23.62 | 46.99,23.62 48.01,23.62 49.78,21.84 51.69,21.84 52.45,21.08 52.45,20.07 53.28,19.24 | 53.28,19.24 53.34,19.18 53.34,19.3 | 51.05,23.11 51.05,28.45 52.32,29.72 U2.3 | 53.28,19.24 53.34,19.3 | 53.34,19.3 53.36,19.32 53.36,22.08 C8.P$2 51.05,23.11 | 53.34,19.3 53.36,19.29 C13.P$1 | 51.05,23.11 R1.P$2 | 29.21,82.3 C3.P$2 | 29.21,82.3 31.75,84.84 37.97,84.84 40.13,82.68 40.13,82.04 U1.8
  Bottom 0.508: J0.10 J0.9 | 10.16,83.06 C10.P$1
  Bottom 0.762: U6.P$1 8.64,85.85 10.16,84.33 10.16,83.06 10.16,82.17 8.38,80.39 6.86,80.39 3.94,77.47 3.94,71.88 5.59,70.23 5.59,67.82 4.06,66.29 J0.9 J0.10
V-  (via drill 0.43 pad 0.94)
  Top 0.508: J0.1 2.16,50.29 2.16,64.39 5.59,67.82 5.59,70.23 2.03,73.79 v2.03,76.71 | J0.1 4.19,50.29 | J0.1 J0.2 | v3.94,80.39 5.21,80.39 6.48,81.66 6.48,83.82 7.75,85.09 9.53,85.09 15.87,91.44 19.92,91.44 C12.P$2 21.97,89.41 28.83,89.41 C9.P$2 U1.4
  Bottom 0.508: v2.03,76.71 2.03,78.49 v3.94,80.39

### Text on the board
tPlace: 50kA | 50kB | 50kB | 50kB | 50kA | 50kB | 1MA | 50kA | x0x-heart pacemaker | openmusiclabs
bPlace: 15 | 13 | 11 | 1 | 9 | 1 | 7 | 5 | 1 | 1 | 6 | 5 | 4 | 1 | 2 | 3 | 1 | 1 | 1 | 1 | 1 | 1 | 1